# EAGLE design test_station_rec (EAGLE 5.11)
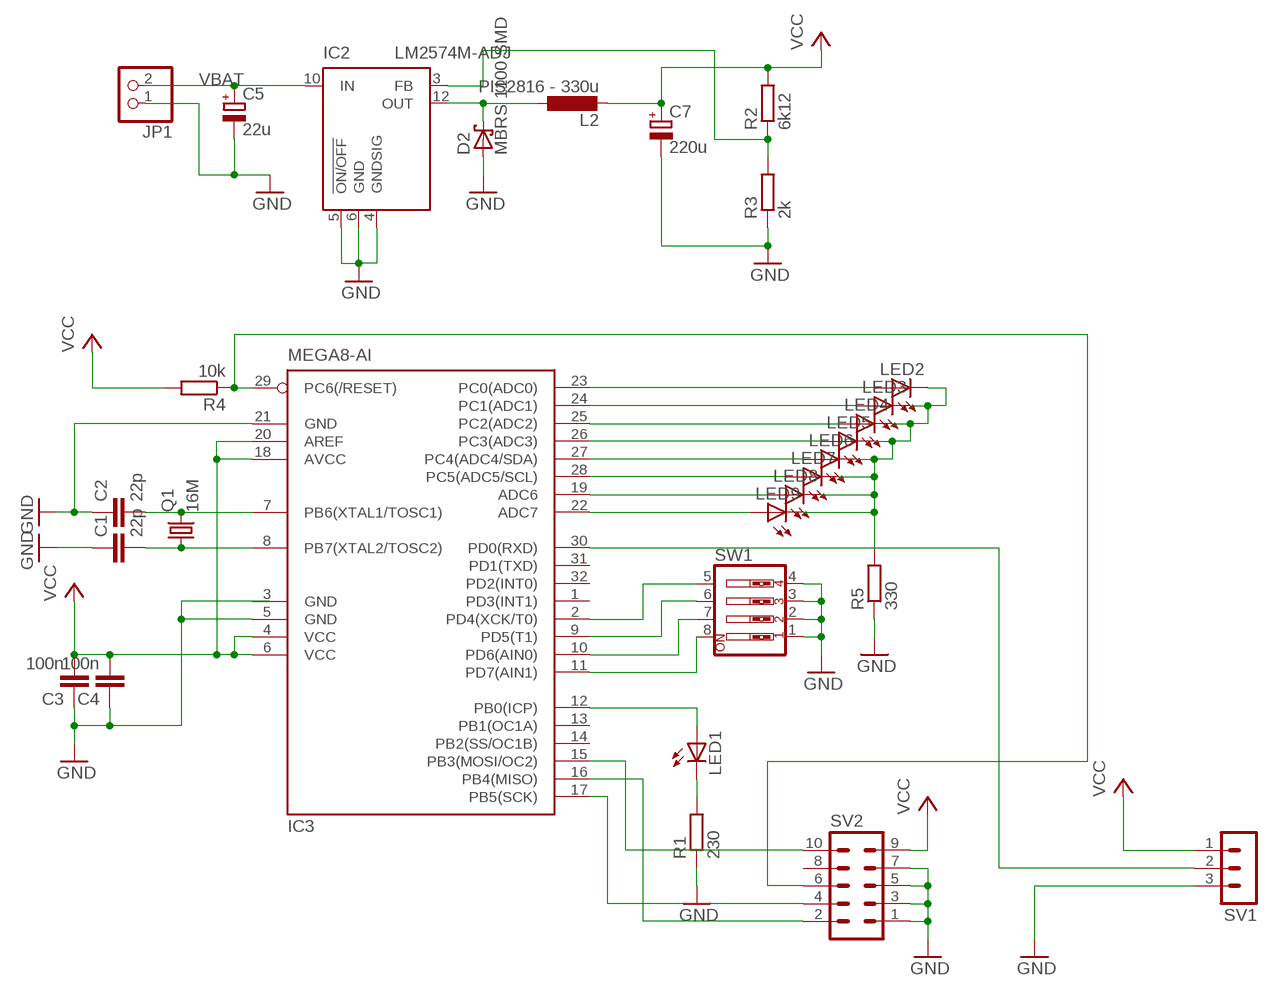
[diagram p0: schematic, sheet 1]

## Parts
C1  22p  C-EUC0805  [C0805]
C2  22p  C-EUC0805  [C0805]
C3  100n  C-EUC0805  [C0805]
C4  100n  C-EUC0805  [C0805]
C5  22u  CPOL-EUCT7343  [CT7343]
C7  220u  CPOL-EUD  [PANASONIC_D]
D2  MBRS 1100 SMD  MBRS130LT3  [SMB]
IC2  LM2574M-ADJ  [SO14W]
IC3  MEGA8-AI  [TQFP32-08]
JP1  PINHD-1X2  [1X02]
L2  PIS2816 - 330u  PIS2816  [PIS2816]
LED1  LEDCHIPLED_1206  [CHIPLED_1206]
LED2  LEDCHIPLED_1206  [CHIPLED_1206]
LED3  LEDCHIPLED_1206  [CHIPLED_1206]
LED4  LEDCHIPLED_1206  [CHIPLED_1206]
LED5  LEDCHIPLED_1206  [CHIPLED_1206]
LED6  LEDCHIPLED_1206  [CHIPLED_1206]
LED7  LEDCHIPLED_1206  [CHIPLED_1206]
LED8  LEDCHIPLED_1206  [CHIPLED_1206]
LED9  LEDCHIPLED_1206  [CHIPLED_1206]
Q1  16M  CRYSTALHC49U70  [HC49U70]
R1  230  R-EU_M0805  [M0805]
R2  6k12  R-EU_M0805  [M0805]
R3  2k  R-EU_M0805  [M0805]
R4  10k  R-EU_M0805  [M0805]
R5  330  R-EU_M0805  [M0805]
SV1  MA03-1  [MA03-1]
SV2  MA05-2  [MA05-2]
SW1  SW_DIP-4  [EDG-04]

## Nets
GND: C1.1 C2.1 C3.1 C4.1 C5.- C7.- D2.A IC2.4(GNDSIG) IC2.5(!ON/OFF) IC2.6(GND) IC3.5(GND) IC3.21(GND) JP1.1 R1.1 R3.1 R5.1 SV1.3 SV2.1 SV2.3 SV2.5 SV2.7 SW1.1 SW1.2 SW1.3 SW1.4
N$1: IC3.23(PC0(ADC0)) LED2.A
N$2: IC3.24(PC1(ADC1)) LED3.A
N$3: IC3.25(PC2(ADC2)) LED4.A
N$4: IC3.26(PC3(ADC3)) LED5.A
N$5: IC3.27(PC4(ADC4/SDA)) LED6.A
N$6: IC3.19(ADC6) LED8.A
N$8: IC3.30(PD0(RXD)) SV1.2
N$9: IC3.11(PD7(AIN1)) SW1.8
N$10: C1.2 IC3.8(PB7(XTAL2/TOSC2)) Q1.1
N$11: C2.2 IC3.7(PB6(XTAL1/TOSC1)) Q1.2
N$12: IC3.22(ADC7) LED9.A
N$13: IC3.28(PC5(ADC5/SCL)) LED7.A
N$14: IC3.12(PB0(ICP)) LED1.A
N$15: LED1.C R1.2
N$16: IC3.15(PB3(MOSI/OC2)) SV2.10
N$19: IC2.3(FB) R2.1 R3.2
N$20: IC3.17(PB5(SCK)) SV2.4
N$21: IC3.16(PB4(MISO)) SV2.2
N$22: D2.C IC2.12(OUT) L2.1
N$23: IC3.29(PC6(/RESET)) R4.1 SV2.6
N$24: LED2.C LED3.C LED4.C LED5.C LED6.C LED7.C LED8.C LED9.C R5.2
N$25: IC3.10(PD6(AIN0)) SW1.7
N$26: IC3.9(PD5(T1)) SW1.6
N$27: IC3.2(PD4(XCK/T0)) SW1.5
VBAT: C5.+ IC2.10(IN) JP1.2
VCC: C3.2 C4.2 C7.+ IC3.4(VCC) IC3.6(VCC) IC3.18(AVCC) IC3.20(AREF) L2.2 R2.2 R4.2 SV1.1 SV2.9
Unconnected: IC3.1(PD3(INT1)) IC3.13(PB1(OC1A)) IC3.14(PB2(SS/OC1B)) IC3.31(PD1(TXD)) IC3.32(PD2(INT0)) SV2.8

## Power pins joined to a net without a drawn wire
GND: IC3.3(GND)

## Library data of the parts
C1-C4 = rcl:C-EU: CAPACITOR, European symbol
C5 C7 = rcl:CPOL-EU: POLARIZED CAPACITOR, European symbol
D2 = diode:MBRS130LT3: Schottky Power Rectifier Source: http://www.onsemi.com/pub/Collateral/MBRS130LT3-D.PDF
IC2 = linear:LM2574?-*: SIMPLE SWITCHER 0.5A Step-Down Voltage Regulator Source: http://cache.national.com/ds/LM/LM2574.pdf
IC3 = atmel:MEGA8: MICROCONTROLLER 8 Kbytes FLASH, 1 kbytes SRAM, 512 bytes EEPROM, USART, 6-channel 10 bit ADC, 2-channel 8 bit ADC Pin compatible with Atmega48, ATMega88, ATMega168 Source: avr.lbr
JP1 = pinhead:PINHD-1X2: PIN HEADER
L2 = Labor:PIS2816
LED1-LED9 = led:LED: LED OSRAM: - CHIPLED LG R971, LG N971, LY N971, LG Q971, LY Q971, LO R971, LY R971 LH N974, LH R974 LS Q976, LO Q976, LY Q976 LO Q996 - Hyper CHIPLED LW Q18S LB Q993, LB Q99A, LB R99A - SideLED LS A670, LO A670, LY A670, LG A670, LP A670 LB A673, LV A673, LT A673, LW A673 LH A674 LY A675 LS A676, LA A676, LO A676, LY A676, LW A676 LS A679, LY A679, LG A679 - Hyper Micro SIDELED® LS Y876, LA Y876, LO Y876, LY Y876 LT Y87S - SmartLED LW L88C, LW L88S LB L89C, LB L89S, LG L890 LS L89K, LO L89K, LY L89K LS L896, LA L896, LO L896, LY L896 - TOPLED LS T670, LO T670, LY T670, LG T670, LP T670 LSG T670, LSP T670, LSY T670, LOP T670, LYG T670 LG T671, LOG T671, LSG T671 LB T673, LV T673, LT T673, LW T673 LH T674 LS T676, LA T676, LO T676, LY T676, LB T676, LH T676, LSB T676, LW T676 LB T67C, LV T67C, LT T67C, LS T67K, LO T67K, LY T67K, LW E67C LS E67B, LA E67B, LO E67B, LY E67B, LB E67C, LV E67C, LT E67C LW T67C LS T679, LY T679, LG T679 LS T770, LO T770, LY T770, LG T770, LP T770 LB T773, LV T773, LT T773, LW T773 LH T774 LS E675, LA E675, LY E675, LS T675 LS T776, LA T776, LO T776, LY T776, LB T776 LHGB T686 LT T68C, LB T68C - Hyper Mini TOPLED® LB M676 - Mini TOPLED Santana® LG M470 LS M47K, LO M47K, LY M47K Source: http://www.osram.convergy.de LUXEON: - LUMILED® LXK2-PW12-R00, LXK2-PW12-S00, LXK2-PW14-U00, LXK2-PW14-V00 LXK2-PM12-R00, LXK2-PM12-S00, LXK2-PM14-U00 LXK2-PE12-Q00, LXK2-PE12-R00, LXK2-PE12-S00, LXK2-PE14-T00, LXK2-PE14-U00 LXK2-PB12-K00, LXK2-PB12-L00, LXK2-PB12-M00, LXK2-PB14-N00, LXK2-PB14-P00, LXK2-PB14-Q00 LXK2-PR12-L00, LXK2-PR12-M00, LXK2-PR14-Q00, LXK2-PR14-R00 LXK2-PD12-Q00, LXK2-PD12-R00, LXK2-PD12-S00 LXK2-PH12-R00, LXK2-PH12-S00 LXK2-PL12-P00, LXK2-PL12-Q00, LXK2-PL12-R00 Source: www.luxeon.com KINGBRIGHT: KA-3528ASYC Source: www.kingbright.com
Q1 = crystal:CRYSTAL: CRYSTAL
R1-R4 = rcl:R-EU_: RESISTOR, European symbol
R5 = resistor:R-EU_: RESISTOR, European symbol
SV1 = con-lstb:MA03-1: PIN HEADER
SV2 = con-lstb:MA05-2: PIN HEADER; OC_FARNELL: unknown; OC_NEWARK: unknown
SW1 = special:SW_DIP-4: DIP SWITCH

## Net classes
0 default: clearance 0.127 mm

## Board
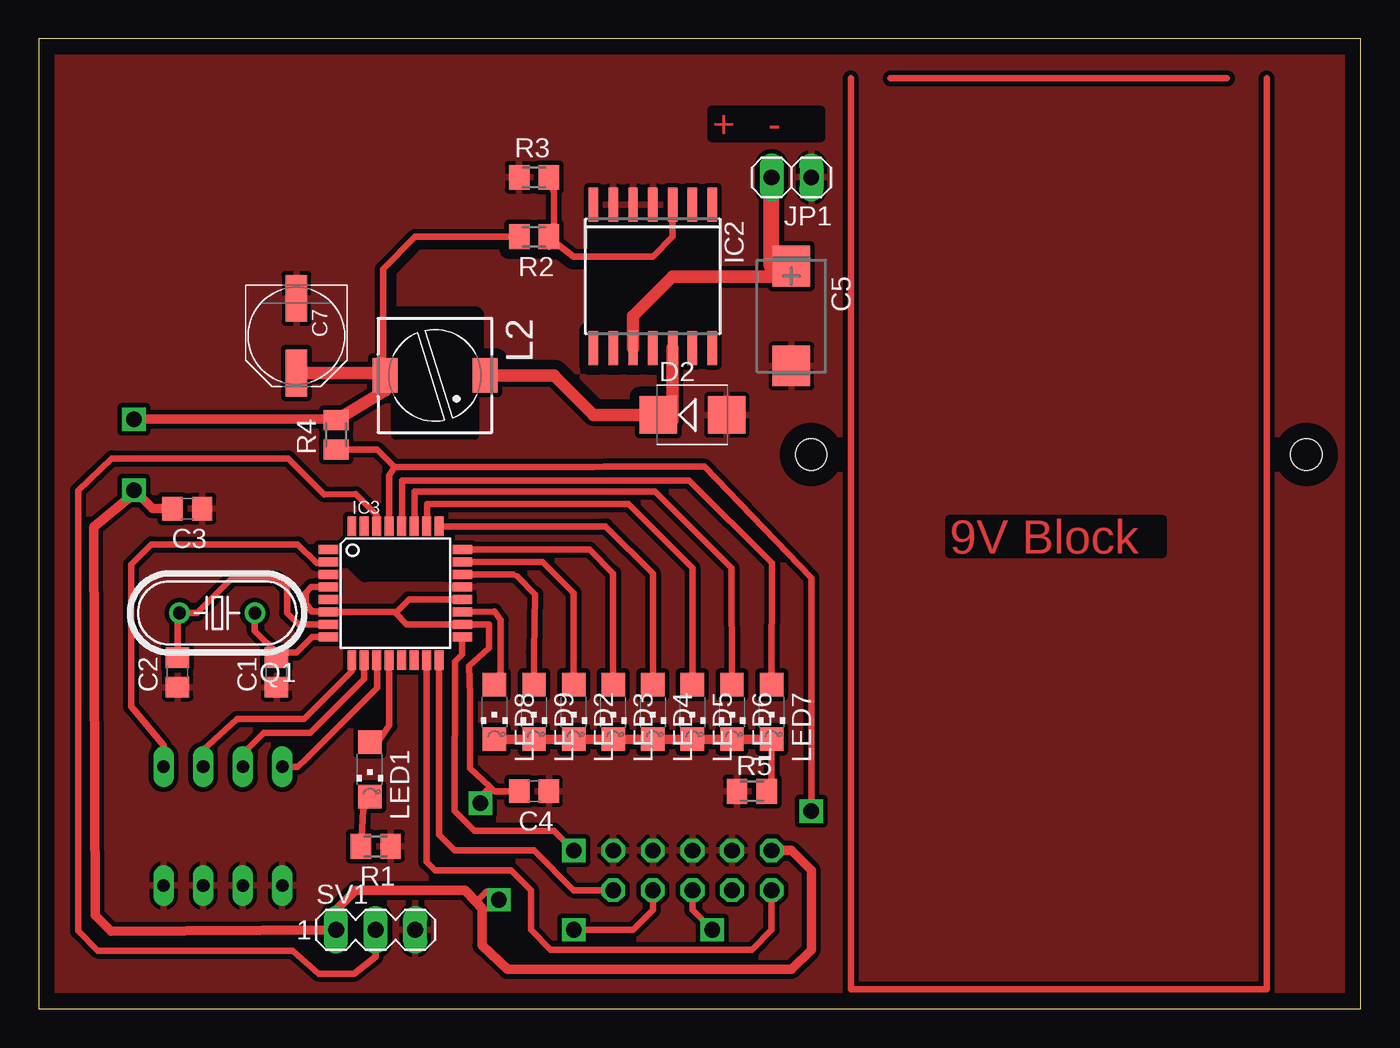
[diagram p1: board, top side]
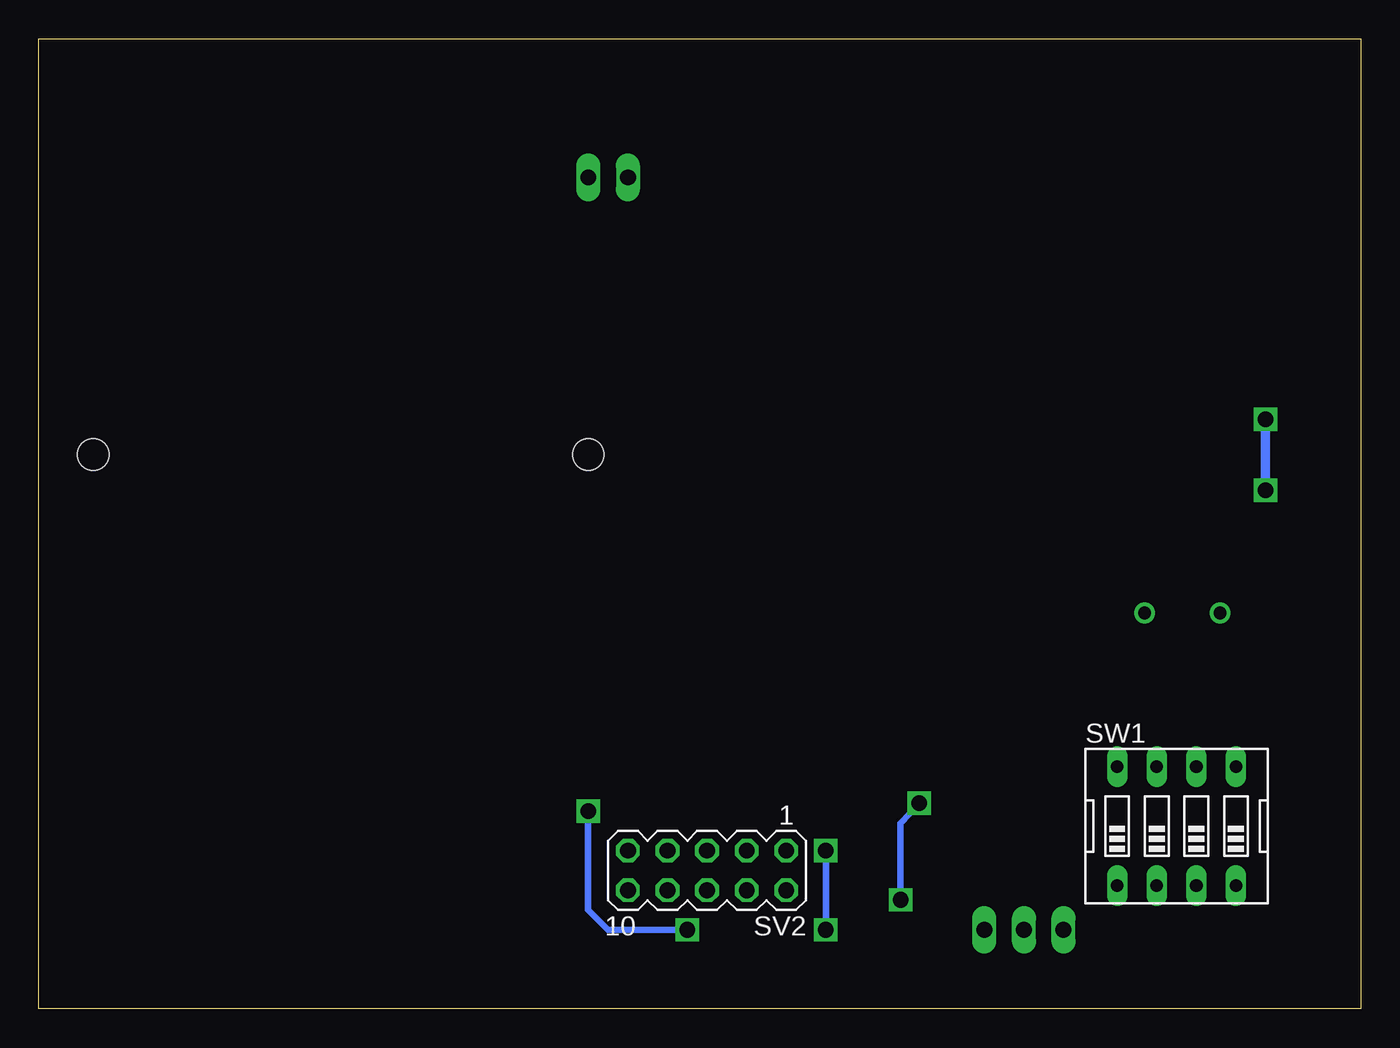
[diagram p2: board, bottom side, seen from below]

Size 84.76 x 62.22 mm. Coordinates in mm from the lower left corner, seen from the top.
Outline: 0,0 84.76,0 84.76,62.22 0,62.22 0,0
Copper layers (1*16): Top 0.035mm / dielectric 1.5mm / Bottom 0.035mm
Design rules "default": minimum track width 10mil, minimum drill 24mil, track to track 8mil, track to pad 8mil, pad to pad 8mil, via to via 8mil, smd to smd 8mil, copper to edge 40mil, drill to drill 8mil, minimum pad ring 10mil, minimum via ring 8mil, stop-mask expansion 4mil, vias tented up to drill 0mil, thermal gap 10mil
Holes 2 mm at 49.53,35.56 81.28,35.56
tRestrict: area 16.5,25.4 to 17.8,26.7; area 35.5,43.5 to 43.4,50.5; area 19.7,27.9 to 26.2,29.9

### Footprints (pad centres in the part's own frame; a part is rotated, then mirrored left to right if it is on the bottom)
C0805 = smd 1.3 x 1.5: 1 -0.95,0; 2 0.95,0
CT7343 = smd 2.6 x 2.4: + -3.2,0; - 3.2,0
PANASONIC_D = smd 3 x 1.4: + 2.4,0; - -2.4,0
SMB = smd 2.4 x 2.4: A 2.2,0; C -2.2,0
SO14W = smd 0.6 x 2.2: 1 -3.81,-4.6; 2 -2.54,-4.6; 3 -1.27,-4.6; 4 0,-4.6; 5 1.27,-4.6; 6 2.54,-4.6; 7 3.81,-4.6; 8 3.81,4.6; 9 2.54,4.6; 10 1.27,4.6; 11 0,4.6; 12 -1.27,4.6; 13 -2.54,4.6; 14 -3.81,4.6
TQFP32-08 = smd 1.27 x 0.559: 1 -4.293,2.8; 2 -4.293,2; 3 -4.293,1.2; 4 -4.293,0.4; 5 -4.293,-0.4; 6 -4.293,-1.2; 7 -4.293,-2; 8 -4.293,-2.8; 17 4.293,-2.8; 18 4.293,-2; 19 4.293,-1.2; 20 4.293,-0.4; 21 4.293,0.4; 22 4.293,1.2; 23 4.293,2; 24 4.293,2.8 | smd 0.559 x 1.27: 9 -2.8,-4.293; 10 -2,-4.293; 11 -1.2,-4.293; 12 -0.4,-4.293; 13 0.4,-4.293; 14 1.2,-4.293; 15 2,-4.293; 16 2.8,-4.293; 25 2.8,4.293; 26 2,4.293; 27 1.2,4.293; 28 0.4,4.293; 29 -0.4,4.293; 30 -1.2,4.293; 31 -2,4.293; 32 -2.8,4.293
1X02 = drill 1.016 long: 1 -1.27,0; 2 1.27,0
PIS2816 = smd 2.2 x 1.6: 1 0,3.2; 2 0,-3.2
CHIPLED_1206 = smd 1.5 x 1.5: A 0,-1.75; C 0,1.75
HC49U70 = drill 0.813 round: 1 -2.413,0; 2 2.413,0
M0805 = smd 1.3 x 1.6: 1 -0.95,0; 2 0.95,0
MA03-1 = drill 1.016 long: 1 -2.54,0; 2 0,0; 3 2.54,0
MA05-2 = drill 1.016 octagon: 1 -5.08,-1.27; 2 -5.08,1.27; 3 -2.54,-1.27; 4 -2.54,1.27; 5 0,-1.27; 6 0,1.27; 7 2.54,-1.27; 8 2.54,1.27; 9 5.08,-1.27; 10 5.08,1.27
EDG-04 = drill 0.813 long: 1 -3.81,-3.81; 2 -1.27,-3.81; 3 1.27,-3.81; 4 3.81,-3.81; 5 3.81,3.81; 6 1.27,3.81; 7 -1.27,3.81; 8 -3.81,3.81

### Placement (x,y rotation side)
C1  15.24,21.59 90 top
C2  8.89,21.59 90 top
C3  9.51,32.09 180 top
C4  31.75,13.97 180 top
C5  48.26,44.45 270 top
C7  16.51,43.18 270 top
D2  41.91,38.1 0 top
IC2  39.37,46.99 180 top
IC3  22.86,26.67 0 top
JP1  48.26,53.34 180 top
L2  25.4,40.64 270 top
LED1  21.22,15.37 180 top
LED2  34.29,19.05 180 top
LED3  36.83,19.05 180 top
LED4  39.37,19.05 180 top
LED5  41.91,19.05 180 top
LED6  44.45,19.05 180 top
LED7  46.99,19.05 180 top
LED8  29.21,19.05 180 top
LED9  31.75,19.05 180 top
Q1  11.43,25.4 180 top
R1  21.6,10.44 180 top
R2  31.75,49.53 180 top
R3  31.75,53.34 0 top
R4  19.05,36.83 90 top
R5  45.72,13.97 0 top
SV1  21.59,5.08 0 top
SV2  41.91,8.89 180 bottom
SW1  11.8,11.73 0 bottom

### Tracks (layer width: path | path; a pad name or v marks a point on that pad's centre or on a via)
GND
  pour Top (isolate 0.305): 0,62.23 0,0 85.09,0 85.09,62.23
N$1
  Top 0.406: LED2.A 34.29,26.67 32.29,28.67 IC3.23
N$2
  Top 0.406: LED3.A 36.83,27.94 35.3,29.47 IC3.24
N$3
  Top 0.406: LED4.A 39.37,27.94 36.35,30.96 IC3.25
N$4
  Top 0.406: IC3.26 24.9,30.96 24.9,32.4 37.8,32.4 41.9,28.3 LED5.A
N$5
  Top 0.406: IC3.27 24.1,30.96 24.1,33.2 39.5,33.2 44.4,28.3 LED6.A
N$6
  Top 0.406: IC3.19 29.21,25.5 29.62,24.94 29.62,21.66 LED8.A
N$7
  pour Top (isolate 0.61): 25.4,49.53 22.86,46.99 22.86,38.1 40.64,38.1 40.64,49.53
N$8
  Top 0.406: SV1.2 21.59,3.34 20.22,2.27 17.93,2.27 16.26,3.74 3.78,3.74 2.51,5.01 2.51,33.25 4.68,35.32 15.98,35.32 18.3,33 20.32,33.02 21.66,31.68 IC3.30
N$9
  Top 0.406: IC3.11 21.7,22.38 21.7,20.6 17.2,16.1 16.6,15.53 SW1.8
N$10
  Top 0.406: Q1.1 13.84,24.26 15.24,22.86 | IC3.8 17.52,23.87 16.51,22.86 15.24,22.86 | C1.2 15.24,22.86
N$11
  Top 0.406: IC3.7 16.64,24.67 15.91,25.4 15.91,26.97 15.24,27.64 12.4,27.64 10.16,25.4 Q1.2 8.89,25.27 C2.2
N$12
  Top 0.406: IC3.22 30.41,27.87 30.68,27.74 31.82,26.6 31.75,22.86 LED9.A
N$13
  Top 0.406: IC3.28 23.3,30.96 23.3,33.9 41.7,33.9 47,28.6 LED7.A
N$14
  Top 0.406: IC3.12 22.46,18.18 21.61,16.94 LED1.A
N$15
  Top 0.406: R1.2 20.8,12.73 LED1.C
N$16
  Top 0.406: IC3.15 24.86,9.43 25.4,8.89 30.28,8.89 31.55,7.62 31.55,5.08 32.82,3.81 45.72,3.81 46.99,5.08 SV2.10
N$17
  Top 0.406: 54.61,59.69 76.2,59.69
N$18
  Top 0.406: 52.07,59.69 52.07,1.27 78.74,1.27 78.74,59.69
N$19
  Top 0.406: 32.7,48.9 R2.1 33.02,49.21 | 33.02,49.21 33.02,52.39 R3.2 | 33.02,49.21 34.29,48.26 39.37,48.26 40.64,49.53 IC2.3
N$20  (via drill 1)
  Top 0.406: IC3.17 27.15,22.75 26.7,22.3 26.65,12.72 27.94,11.43 33.02,11.43 v34.29,10.16 | SV2.4 39.37,6.35 38.1,5.08 v34.29,5.08
  Bottom 0.406: v34.29,5.08 v34.29,10.16
N$21
  Top 0.406: IC3.16 25.66,11.17 26.67,10.16 31.75,10.16 34.29,7.62 SV2.2
N$22
  Top 0.813: 40.64,38.1 40.64,37.76 D2.C | 40.64,38.1 IC2.12 | L2.1 33.02,40.64 35.56,38.1 40.64,38.1
N$23  (via drill 1)
  Top 0.406: IC3.29 22.46,34.21 22.81,34.76 | v43.18,5.08 41.91,6.35 SV2.6 | v49.53,12.7 49.53,27.65 42.69,34.79 36.23,34.79 35.56,34.76 22.81,34.76 | R4.1 21.69,35.88 22.81,34.76
  Bottom 0.406: v43.18,5.08 48.26,5.08 49.53,6.35 v49.53,12.7
N$24
  Top 0.406: LED7.C 46.99,14.29 R5.2
  Top 0.61: LED2.C LED3.C LED4.C LED5.C LED6.C LED7.C LED8.C LED9.C
N$25
  Top 0.406: IC3.10 20.86,21.16 17.4,17.7 14.4,17.7 13.1,16.4 13.1,15.37 SW1.7
N$26
  Top 0.406: IC3.9 20.06,21.66 17,18.6 12.7,18.6 10.5,16.6 10.5,15.41 SW1.6
N$27
  Top 0.406: SW1.5 7.99,16.91 5.9,19.4 5.9,28.5 7.2,29.8 16.6,29.8 17.8,28.6 18.5,28.6 IC3.2
VBAT
  Top 0.813: IC2.10 38.1,44.45 40.64,46.99 47.65,46.99 C5.+
  Top 1.016: JP1.2 46.99,47.65 C5.+
VCC  (via drill 1)
  Top 0.406: 22.86,25.4 22.79,25.47 IC3.6 18.54,25.5 17.5,25.5 17.1,26 17.1,26.7 17.47,27.07 IC3.4 | 22.86,25.4 23.59,24.67 IC3.18 28.87,24.67 28.87,23.17 27.6,22 27.64,20.12 27.64,15.44 28.93,14.23 | IC3.20 23.73,26.27 22.86,25.4 | C4.2 29.21,13.97 28.93,14.23 | 22.06,40.78 22.06,47.46 24.13,49.53 R2.2 | v29.5,7 29.08,7.52 28.69,7.52 28.03,6.86 | v28.3,13.2 28.3,13.6 28.93,14.23
  Top 0.61: SV2.9 48.26,10.16 49.53,8.89 49.53,3.81 48.26,2.54 30.05,2.54 28.41,4.08 28.41,6.45 28.03,6.86 27.34,7.62 20.32,7.62 19.05,6.35 SV1.1 4.62,4.98 3.6,6 3.5,30.9 5.9,32.9 6.18,33.3 v6.1,33.28 7.29,32.09 C3.2 | v6.1,37.83 19,37.83 R4.2
  Top 0.813: R4.2 22.2,39.66 L2.2 22.06,40.78 C7.+
  Bottom 0.406: v29.5,7 29.5,11.9 v28.3,13.2
  Bottom 0.61: v6.1,33.28 v6.1,37.83

### Text on the board
Top: + - | 9V Block